# EAGLE design round_paws_2 (EAGLE 9.6.2)
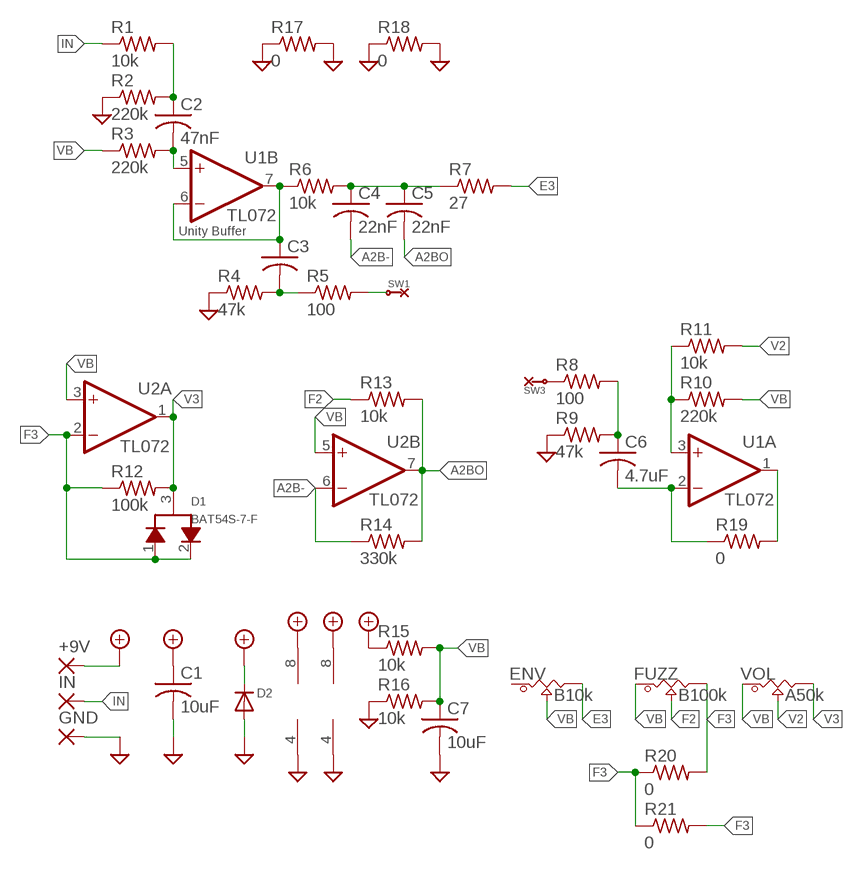
[diagram p0: schematic, sheet 1]

## Parts
+9V  SMD2  [SMD1,27-2,54]
C1  10uF  C-USC1206  [C1206]
C2  47nF  C-USC0603  [C0603]
C3  C-USC0603  [C0603]
C4  22nF  C-USC0603  [C0603]
C5  22nF  C-USC0603  [C0603]
C6  4.7uF  C-USC1206  [C1206]
C7  10uF  C-USC1206  [C1206]
D1  BAT54S-7-F  [SOT23-3]
D2  DIODESOD-123  [SOD-123]
ENV  B10k  POT_9MM_SMD  [POT_9MM_SMD]
FUZZ  B100k  POT_9MM_SMD  [POT_9MM_SMD]
GND  SMD2  [SMD1,27-2,54]
IN  SMD2  [SMD1,27-2,54]
R1  10k  R-US_R0603  [R0603]
R2  220k  R-US_R0603  [R0603]
R3  220k  R-US_R0603  [R0603]
R4  47k  R-US_R0603  [R0603]
R5  100  R-US_R0603  [R0603]
R6  10k  R-US_R0603  [R0603]
R7  27  R-US_R0603  [R0603]
R8  100  R-US_R0603  [R0603]
R9  47k  R-US_R0603  [R0603]
R10  220k  R-US_R0603  [R0603]
R11  10k  R-US_R0603  [R0603]
R12  100k  R-US_R0603  [R0603]
R13  10k  R-US_R0603  [R0603]
R14  330k  R-US_R0603  [R0603]
R15  10k  R-US_R0603  [R0603]
R16  10k  R-US_R0603  [R0603]
R17  0  R-US_R0402  [R0402]
R18  0  R-US_R0402  [R0402]
R19  0  R-US_R0402  [R0402]
R20  0  R-US_R0402  [R0402]
R21  0  R-US_R0402  [R0402]
SW1  COM_SMD  [1PAD]
SW3  COM_SMD  [1PAD]
U1  TL072  TL072TSSOP  [TSSOP-8]
U2  TL072  TL072TSSOP  [TSSOP-8]
VOL  A50k  POT_9MM_SMD  [POT_9MM_SMD]

## Nets
1B+: C2.2 R3.2 U1.5(B:+IN)
+9V: +9V.1(P) C1.1 D2.C R15.1 U1.8(P:V+) U2.8(P:V+)
A1A+: R10.1 R11.1 U1.3(A:+IN)
A1AO: C6.2 R19.1 R19.2 U1.1(A:OUT) U1.2(A:-IN)
A1BO: C3.1 R6.1 U1.6(B:-IN) U1.7(B:OUT)
A2B-: C4.2 R14.1 U2.6(B:-IN)
A2BO: C5.2 R13.2 R14.2 U2.7(B:OUT)
E3: ENV.3 R7.2
F2: FUZZ.2 R13.1
F3: D1.1 D1.2 FUZZ.3 R12.1 R20.1 R20.2 R21.1 R21.2 U2.2(A:-IN)
GND: C1.2 C7.2 D2.A GND.1(P) R2.1 R4.1 R9.1 R16.1 R17.1 R17.2 R18.1 R18.2 U1.4(P:V-) U2.4(P:V-)
IN: IN.1(P) R1.1
N$1: C2.1 R1.2 R2.2
N$2: C6.1 R8.2 R9.2
N$3: R8.1 SW3.1
N$4: C3.2 R4.2 R5.1
N$5: R5.2 SW1.1
N$6: C4.1 C5.1 R6.2 R7.1
V2: R11.2 VOL.2
V3: D1.3 R12.2 U2.1(A:OUT) VOL.3
VB: C7.1 ENV.2 FUZZ.1 R3.1 R10.2 R15.2 R16.2 U2.3(A:+IN) U2.5(B:+IN) VOL.1
Unconnected: ENV.1

## Notes on the sheet
- Unity Buffer

## Library data of the parts
+9V GND IN = wirepad:SMD2: SMD PAD
C1-C7 = adafruit:C-US: CAPACITOR, American symbol
D1 = Diodes:BAT54S-7-F: DIODE ARRAY SCHOTTKY 30V SOT23-3 Manufacturer's datasheet <https://www.diodes.com/assets/Datasheets/ds11005.pdf>; CREATED_BY: PCBLayout.com; DIGIKEY_PART_NUMBER: BAT54S-FDITR-ND; MANUFACTURER: Diodes Incorporated; MPN: BAT54S-7-F; PACKAGE: SOT-23
D2 = adafruit:DIODE: Diode SMADIODE - SMA Surface Mount Package 20V 1A Schottky Diode Digikey: 641-1014-6-ND DO-1N4148 - Through Hole Small Current Diode SOD-123 20V 1 A (.5mV Vf) Schottky Diode - Digikey: MBRX120TPMSCT-ND SOD-323 10V 570mA (.38mV Vf, 3ns) Schottky Diode - Digikey: ZLLS410CT-ND SOD-523 30V 30mA Schottky Diode (RB751S-40TE61) - Digikey: RB751S-40TE61CT-ND SOT23-R/W - SOT23 Package (R = Solder Paste/Reflow Ovens, W = Hand-Soldering) BAT54Film 40V 300mA - Digikey: 497-7162-1-ND
ENV FUZZ VOL = Mech_BO_CE_SW:POT_9MM_SMD
R1-R21 = adafruit:R-US_: RESISTOR, American symbol
SW1 SW3 = Mech_BO_CE_SW:COM_SMD
U1 U2 = MusicThingModular:TL072: Generic Dual Op Amp

## Board
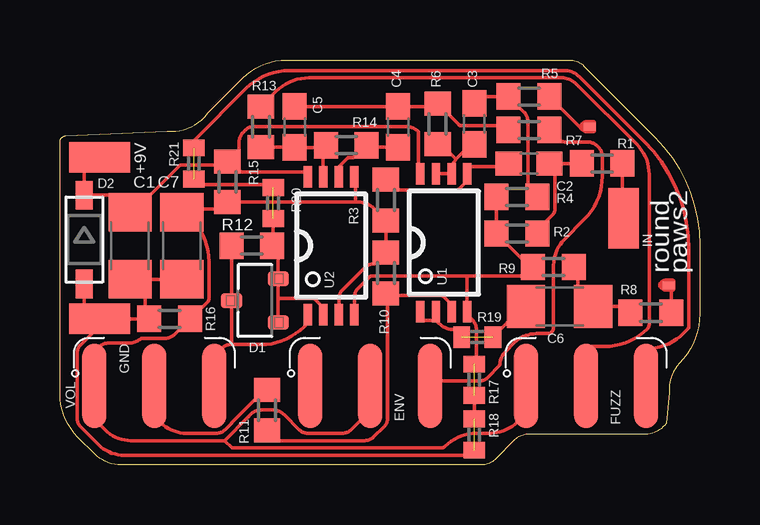
[diagram p1: board, top side]

Size 26.67 x 16.89 mm. Coordinates in mm from the lower left corner, seen from the top.
Outline: 24.51,1.27 19.49,1.27 arc45 18.95,1.05 18.13,0.22 arc-45 17.59,0 2.54,0 arc-45 1.46,0.45 0.74,1.16 arc-45 0,2.96 0,13.47 arc-87 0.24,13.73 4.48,13.92 arc57 6.16,14.67 7.64,16.15 arc-45 9.43,16.89 21.22,16.89 arc-45 21.85,16.63 24.81,13.67 arc-45 26.67,9.18 26.67,6.3 arc-45 25.82,4.23 arc45 25.4,3.04 25.27,1.73 arc-45 24.51,1.27
Copper layers (1*16): Top 0.035mm / dielectric 1.5mm / Bottom 0.035mm
Design rules "default *": minimum track width 6mil, minimum drill 0.35mm, track to track 6mil, track to pad 6mil, pad to pad 6mil, via to via 6mil, smd to smd 6mil, copper to edge 10mil, drill to drill 6mil, minimum pad ring 10mil, minimum via ring 8mil, stop-mask expansion 4mil, vias tented up to drill 0mil, thermal gap 10mil

### Footprints (pad centres in the part's own frame; a part is rotated, then mirrored left to right if it is on the bottom)
SMD1,27-2,54 = smd 1.27 x 2.54: 1 0,0
C1206 = smd 1.6 x 1.8: 1 -1.4,0; 2 1.4,0
C0603 = smd 1.1 x 1: 1 -0.85,0; 2 0.85,0
SOT23-3 = smd 0.63 x 0.9: 1 -0.915,-0.975; 2 0.915,-0.975; 3 0,0.975
SOD-123 = smd 1.2 x 0.7: A 1.85,0; C -1.85,0
POT_9MM_SMD = smd 0.991 x 3.505: 1 -2.5,0; 2 0,0; 3 2.5,0
R0603 = smd 1 x 1.1: 1 -0.85,0; 2 0.85,0
R0402 = smd 0.7 x 0.9: 1 -0.65,0; 2 0.65,0
1PAD = smd 0.31 x 0.5: 1 0,0.267
TSSOP-8 = smd 0.9 x 0.35: 1 -2.875,0.975; 2 -2.875,0.325; 3 -2.875,-0.325; 4 -2.875,-0.975; 5 2.875,-0.975; 6 2.875,-0.325; 7 2.875,0.325; 8 2.875,0.975

### Placement (x,y rotation side)
+9V  1.65,12.83 90 top
C1  2.92,9.14 270 top
C2  19.56,12.57 180 top
C3  17.27,14.22 90 top
C4  14.1,14.1 270 top
C5  9.78,14.1 270 top
C6  20.83,6.6 180 top
C7  5.08,9.14 270 top
D1  8.13,6.86 90 top
D2  1.02,9.4 270 top
ENV  12.94,3.3 0 top
FUZZ  21.94,3.3 0 top
GND  1.65,6.1 90 top
IN  23.5,10.29 180 top
R1  22.61,12.57 180 top
R2  19.05,9.65 0 top
R3  13.59,11.05 90 top
R4  19.05,11.18 0 top
R5  19.56,15.37 0 top
R6  15.75,14.22 90 top
R7  19.56,13.97 0 top
R8  24.64,6.35 180 top
R9  20.57,8.26 0 top
R10  13.59,8 90 top
R11  8.64,2.29 90 top
R12  8,9.14 180 top
R13  8.38,14.1 270 top
R14  11.94,13.34 180 top
R15  6.99,11.81 270 top
R16  4.57,6.1 0 top
R17  17.27,3.56 90 top
R18  17.27,1.27 90 top
R19  17.4,5.33 180 top
R20  8.89,10.92 270 top
R21  5.59,12.57 90 top
SW1  22.35,14.1 90 top
SW3  25.65,7.49 90 top
U1  16,9.27 90 top
U2  11.3,9.14 90 top
VOL  3.94,3.3 0 top

### Tracks (layer width: path | path; a pad name or v marks a point on that pad's centre or on a via)
1B+
  Top 0.152: R3.2 13.87,11.62 arc45 14.23,11.47 16.51,11.47 arc45 16.66,11.53 16.98,11.85 U1.5 16.98,12.4 17.02,12.45 18.58,12.45 C2.2
+9V
  Top 0.152: +9V.1 1.02,12.19 D2.C 2.22,11.25 C1.1 3.06,10.54 5.01,12.5 6.83,12.5 R15.1 | U2.8 10.33,12.15 10.26,12.21 7.68,12.21 arc-45 7.32,12.36 7,12.68 R15.1 | U1.8 14.95,12.22 14.95,13.89 arc45 14.42,14.11 8.09,14.11 arc45 7.73,13.96 7.62,13.86 arc45 7.48,13.5 7.48,13.15 R15.1
A1A+
  Top 0.152: R11.1 9.06,1.02 12.72,1.02 arc45 13.08,1.17 13.51,1.6 arc45 13.66,1.96 13.66,7.08 R10.1 13.66,7.08 15.86,7.08 arc-45 16.01,7.01 16.33,6.69 U1.3
A1AO  (1 unrouted)
  Top 0.152: U1.1 15.03,6.14 15.14,6.03 15.68,6.03 | R19.1 19.32,6.6 C6.2 | U1.2 15.68,6.03 | R19.2 16.44,5.64 arc-45 15.8,5.91 15.68,6.03
A1BO
  Top 0.152: C3.1 17.14,13.37 16.52,12.75 | R6.1 15.89,13.37 16.52,12.75 | U1.7 U1.6 16.33,12.29 arc-45 16.52,12.75
A2B-
  Top 0.152: U2.6 11.63,12.38 arc-45 11.66,12.47 11.99,12.79 arc-45 12.08,12.83 12.23,12.83 arc45 12.32,12.86 R14.1 12.79,13.25 C4.2
A2BO
  Top 0.152: U2.7 10.98,13.22 | 10.98,13.22 R14.2 | 10.98,13.22 9.8,13.22 C5.2 R13.2
E3
  Top 0.152: R7.2 20.77,13.61 arc45 21.13,13.46 22.03,13.46 arc-45 22.39,13.31 22.46,13.24 arc-45 22.61,12.88 22.61,12.04 arc-45 21.87,10.25 21.03,9.4 arc45 20.58,8.33 20.58,5.73 arc-90 20.33,5.47 19.86,5.47 arc45 18.96,5.1 18.57,4.71 arc45 18.33,4.14 17.84,3.65 arc-45 17.48,3.5 15.44,3.5 ENV.3
F2
  Top 0.152: R13.1 9.02,15.58 arc-45 10.38,16.15 20.91,16.15 arc-45 21.53,15.88 24.05,13.37 arc-45 24.57,12.12 24.57,5.86 arc-45 24.49,5.68 arc-45 22.7,4.94 22.17,4.94 21.94,4.7 FUZZ.2
F3  (2 unrouted)
  Top 0.152: D1.1 9.1,6.99 | 9.1,6.99 D1.2 9.1,8.89 R12.1 8.89,9.18 R20.2 | U2.2 10.98,6.57 10.63,6.91 arc45 10.54,6.95 9.14,6.95 9.1,6.99 | R20.1 8.76,11.57 8.65,11.69 5.82,11.69 R21.1 | R21.2 5.59,13.53 7.77,15.71 arc-45 9.56,16.45 21.03,16.45 arc-45 21.66,16.19 24.36,13.49 arc-45 26.22,9 26.22,5.76 arc-45 26.18,5.67 26.01,5.5 arc-45 24.44,4.85 FUZZ.3
GND  (2 unrouted)
  Top 0.152: R16.1 3.56,6.1 | 3.56,6.1 GND.1 | D2.A 1.02,5.97 1.52,5.97 GND.1 | 3.56,6.1 3.56,7.11 C1.2 C7.2 | 17.02,7.89 13.06,7.89 arc45 12.88,7.81 12.43,7.36 arc45 12.28,7 U2.4 12.3,6.29 | R4.1 R2.1 19.6,8.26 R9.1 19.72,8.04 19.57,7.89 17.02,7.89 | R18.1 17.05,0.4 2.69,0.4 arc-45 1.61,0.85 0.86,1.6 arc-45 0.71,1.96 0.71,4.65 arc-45 0.86,5.01 1.65,5.8 GND.1 | R17.1 R18.2 | R17.2 17.36,4.29 17.36,5.68 arc45 17.21,6.04 16.98,6.27 U1.4 16.98,7.85 17.02,7.89
IN
  Top 0.152: R1.1 23.46,10.33 IN.1
N$1
  Top 0.152: R1.2 20.7,12.57 | 20.7,12.57 C2.1 | R2.2 19.9,9.8 20.57,10.47 arc45 20.63,10.62 20.63,12.5 20.7,12.57
N$2
  Top 0.152: R8.2 23.53,6.6 C6.1 21.59,7.24 21.59,8.09 R9.2
N$3
  Top 0.152: SW3.1 25.49,7.39 R8.1
N$4
  Top 0.152: C3.2 17.57,15.37 R5.1 19.35,14.72 arc-45 19.5,14.36 19.5,11.57 R4.2
N$5
  Top 0.152: SW1.1 21.68,14.1 R5.2
N$6
  Top 0.152: C5.1 C4.1 15.62,14.95 R6.2 16.63,14.19 arc45 16.72,14.15 18.52,14.15 R7.1
V2
  Top 0.152: VOL.2 3.94,2.03 4.2,1.77 arc45 5.28,1.32 6.53,1.32 arc45 6.89,1.47 7.16,1.75 arc-45 7.17,1.78 8.53,3.14 R11.2
V3
  Top 0.152: U2.1 10.33,5.92 10.17,5.76 arc-45 8.37,5.02 7.11,5.02 | R12.2 D1.3 7.15,5.06 7.11,5.02 | VOL.3 6.58,3.45 6.58,4.49 arc-90 7.11,5.02
VB
  Top 0.152: 6.86,1.02 2.96,1.02 arc-45 1.88,1.46 1.44,1.91 VOL.1 1.4,3.34 1.4,4.7 1.63,4.93 arc-45 1.99,5.08 2.89,5.08 arc45 3.38,5.28 4.4,5.28 arc45 4.76,5.43 R16.2 5.46,6.1 6.17,6.81 arc45 6.21,6.9 6.21,8.49 arc45 5.46,10.29 5.21,10.54 C7.1 5.21,10.67 6.7,10.67 R15.2 12.32,10.96 | FUZZ.1 19.44,2.16 19.07,1.8 arc-45 17.94,1.33 17.37,1.33 arc45 16.05,0.78 arc-45 15.88,0.71 7.17,0.71 6.86,1.02 | ENV.2 12.94,2.27 12.14,1.47 arc-45 11.78,1.32 10.34,1.32 arc-45 9.98,1.47 9.36,2.09 arc45 8.87,2.29 8.4,2.29 arc45 7.92,2.09 7.86,2.03 arc-45 7.84,2 6.86,1.02 | U2.3 11.63,6.93 arc-45 11.78,7.29 12.72,8.23 arc-45 13.08,8.38 arc45 13.15,8.41 R10.2 R3.1 13.09,10.7 arc45 12.46,10.96 12.32,10.96 | U2.5 12.32,11.98 12.32,10.96

### Text on the board
tPlace: round | paws2